# Altium schematic sheet STM32F407VG_A.SchDoc
size A4; SheetNumber: 3; SheetTotal: 8
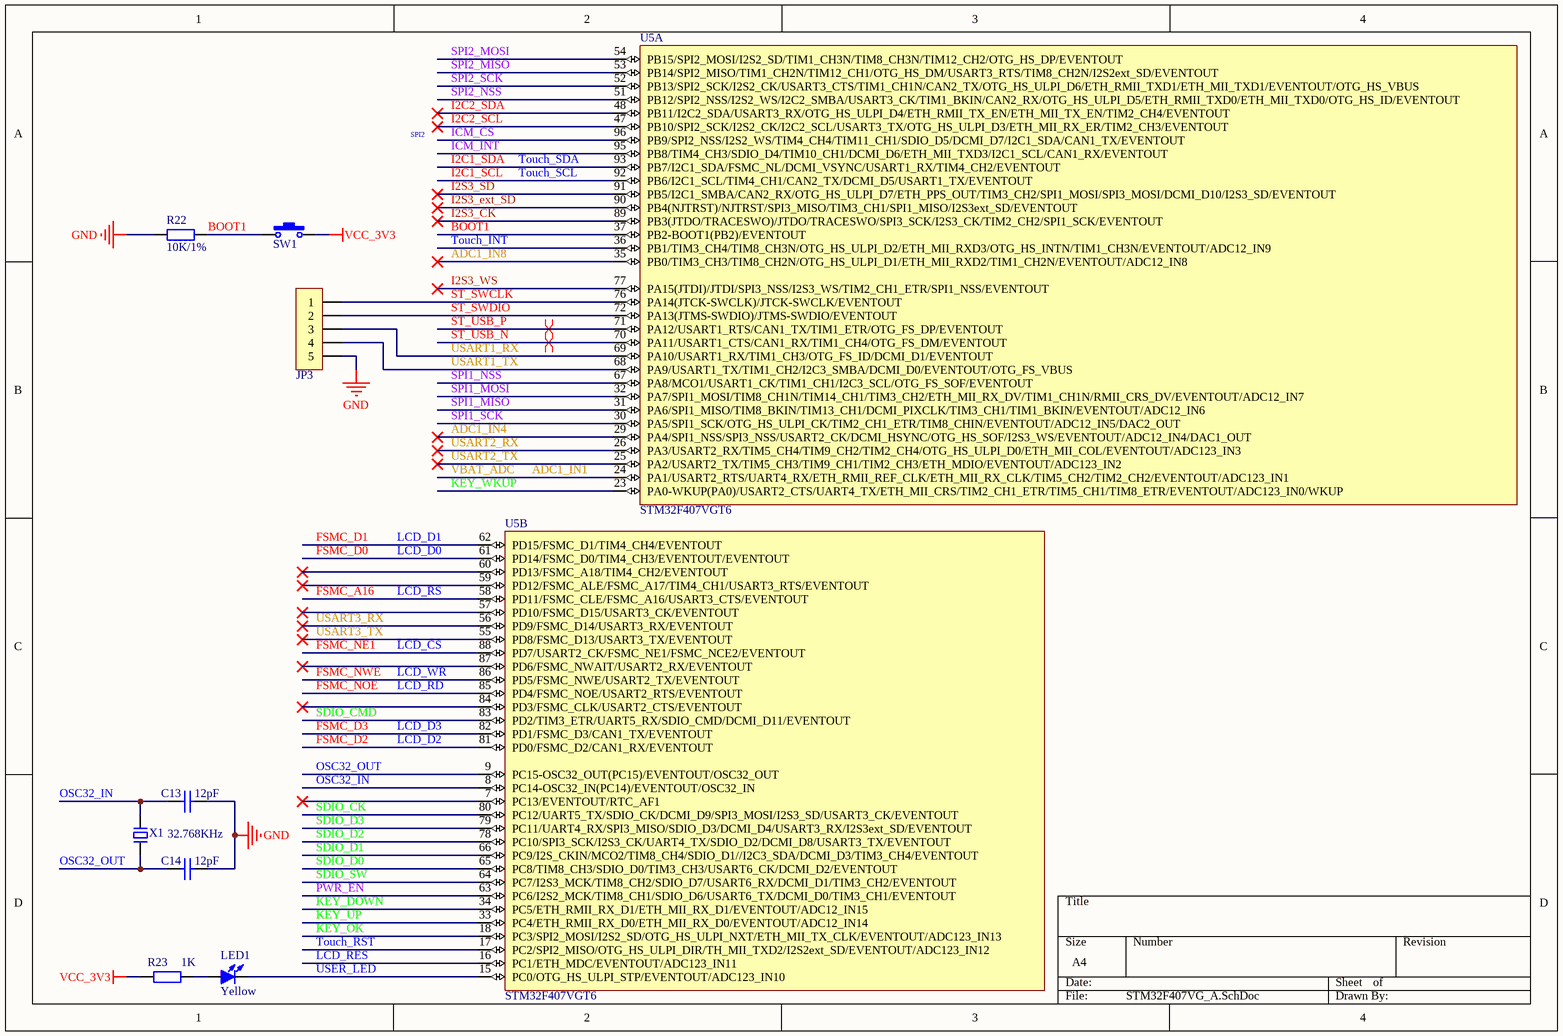
[diagram p0: STM32F407VG_A.SchDoc]

## Parts
C13  12pF  [C0402_L]
C14  12pF  [C0402_L]
JP3  HDR-1X5  [HDR1.27-LI-5P]  (value not drawn)
LED1  Yellow  [LED0402]
R22  10K/1%  [R0402_L]
R23  1K  [R0402_L]
SW1  小龟按键  [3*4两脚小龟按键]  (value not drawn)
U5  STM32F407VGT6  [LQFP100_L]  (parts A,B of 5)
X1  32.768KHz  [XTAL-3215-2P]

## Nets
GND: C13.1 C14.1 JP3.5 R22.1
VCC_3V3: R23.1 SW1.2
ADC1_IN1: U5.24(PA1/USART2_RTS/UART4_RX/ETH_RMII_REF_CLK/ETH_MII_RX_CLK/TIM5_CH2/TIM2_CH2/EVENTOUT/ADC123_IN1)  [also labelled VBAT_ADC]
ADC1_IN4: U5.29(PA4/SPI1_NSS/SPI3_NSS/USART2_CK/DCMI_HSYNC/OTG_HS_SOF/I2S3_WS/EVENTOUT/ADC12_IN4/DAC1_OUT)
ADC1_IN8: U5.35(PB0/TIM3_CH3/TIM8_CH2N/OTG_HS_ULPI_D1/ETH_MII_RXD2/TIM1_CH2N/EVENTOUT/ADC12_IN8)
BOOT1: R22.2 SW1.1 U5.37(PB2-BOOT1(PB2)/EVENTOUT)
FSMC_A16: U5.58(PD11/FSMC_CLE/FSMC_A16/USART3_CTS/EVENTOUT)  [also labelled LCD_RS]
FSMC_D0: U5.61(PD14/FSMC_D0/TIM4_CH3/EVENTOUT/EVENTOUT)  [also labelled LCD_D0]
FSMC_D1: U5.62(PD15/FSMC_D1/TIM4_CH4/EVENTOUT)  [also labelled LCD_D1]
FSMC_D2: U5.81(PD0/FSMC_D2/CAN1_RX/EVENTOUT)  [also labelled LCD_D2]
FSMC_D3: U5.82(PD1/FSMC_D3/CAN1_TX/EVENTOUT)  [also labelled LCD_D3]
FSMC_NE1: U5.88(PD7/USART2_CK/FSMC_NE1/FSMC_NCE2/EVENTOUT)  [also labelled LCD_CS]
FSMC_NOE: U5.85(PD4/FSMC_NOE/USART2_RTS/EVENTOUT)  [also labelled LCD_RD]
FSMC_NWE: U5.86(PD5/FSMC_NWE/USART2_TX/EVENTOUT)  [also labelled LCD_WR]
I2C1_SCL: U5.92(PB6/I2C1_SCL/TIM4_CH1/CAN2_TX/DCMI_D5/USART1_TX/EVENTOUT)  [also labelled Touch_SCL]
I2C1_SDA: U5.93(PB7/I2C1_SDA/FSMC_NL/DCMI_VSYNC/USART1_RX/TIM4_CH2/EVENTOUT)  [also labelled Touch_SDA]
I2C2_SCL: U5.47(PB10/SPI2_SCK/I2S2_CK/I2C2_SCL/USART3_TX/OTG_HS_ULPI_D3/ETH_MII_RX_ER/TIM2_CH3/EVENTOUT)
I2C2_SDA: U5.48(PB11/I2C2_SDA/USART3_RX/OTG_HS_ULPI_D4/ETH_RMII_TX_EN/ETH_MII_TX_EN/TIM2_CH4/EVENTOUT)
I2S3_CK: U5.89(PB3(JTDO/TRACESWO)/JTDO/TRACESWO/SPI3_SCK/I2S3_CK/TIM2_CH2/SPI1_SCK/EVENTOUT)
I2S3_ext_SD: U5.90(PB4(NJTRST)/NJTRST/SPI3_MISO/TIM3_CH1/SPI1_MISO/I2S3ext_SD/EVENTOUT)
I2S3_SD: U5.91(PB5/I2C1_SMBA/CAN2_RX/OTG_HS_ULPI_D7/ETH_PPS_OUT/TIM3_CH2/SPI1_MOSI/SPI3_MOSI/DCMI_D10/I2S3_SD/EVENTOUT)
I2S3_WS: U5.77(PA15(JTDI)/JTDI/SPI3_NSS/I2S3_WS/TIM2_CH1_ETR/SPI1_NSS/EVENTOUT)
ICM_CS: U5.96(PB9/SPI2_NSS/I2S2_WS/TIM4_CH4/TIM11_CH1/SDIO_D5/DCMI_D7/I2C1_SDA/CAN1_TX/EVENTOUT)
ICM_INT: U5.95(PB8/TIM4_CH3/SDIO_D4/TIM10_CH1/DCMI_D6/ETH_MII_TXD3/I2C1_SCL/CAN1_RX/EVENTOUT)
KEY_DOWN: U5.34(PC5/ETH_RMII_RX_D1/ETH_MII_RX_D1/EVENTOUT/ADC12_IN15)
KEY_OK: U5.18(PC3/SPI2_MOSI/I2S2_SD/OTG_HS_ULPI_NXT/ETH_MII_TX_CLK/EVENTOUT/ADC123_IN13)
KEY_UP: U5.33(PC4/ETH_RMII_RX_D0/ETH_MII_RX_D0/EVENTOUT/ADC12_IN14)
KEY_WKUP: U5.23(PA0-WKUP(PA0)/USART2_CTS/UART4_TX/ETH_MII_CRS/TIM2_CH1_ETR/TIM5_CH1/TIM8_ETR/EVENTOUT/ADC123_IN0/WKUP)
LCD_RES: U5.16(PC1/ETH_MDC/EVENTOUT/ADC123_IN11)
OSC32_IN: C13.2 U5.8(PC14-OSC32_IN(PC14)/EVENTOUT/OSC32_IN) X1.2
OSC32_OUT: C14.2 U5.9(PC15-OSC32_OUT(PC15)/EVENTOUT/OSC32_OUT) X1.1
PWR_EN: U5.63(PC6/I2S2_MCK/TIM8_CH1/SDIO_D6/USART6_TX/DCMI_D0/TIM3_CH1/EVENTOUT)
SDIO_CK: U5.80(PC12/UART5_TX/SDIO_CK/DCMI_D9/SPI3_MOSI/I2S3_SD/USART3_CK/EVENTOUT)
SDIO_CMD: U5.83(PD2/TIM3_ETR/UART5_RX/SDIO_CMD/DCMI_D11/EVENTOUT)
SDIO_D0: U5.65(PC8/TIM8_CH3/SDIO_D0/TIM3_CH3/USART6_CK/DCMI_D2/EVENTOUT)
SDIO_D1: U5.66(PC9/I2S_CKIN/MCO2/TIM8_CH4/SDIO_D1//I2C3_SDA/DCMI_D3/TIM3_CH4/EVENTOUT)
SDIO_D2: U5.78(PC10/SPI3_SCK/I2S3_CK/UART4_TX/SDIO_D2/DCMI_D8/USART3_TX/EVENTOUT)
SDIO_D3: U5.79(PC11/UART4_RX/SPI3_MISO/SDIO_D3/DCMI_D4/USART3_RX/I2S3ext_SD/EVENTOUT)
SDIO_SW: U5.64(PC7/I2S3_MCK/TIM8_CH2/SDIO_D7/USART6_RX/DCMI_D1/TIM3_CH2/EVENTOUT)
SPI1_MISO: U5.31(PA6/SPI1_MISO/TIM8_BKIN/TIM13_CH1/DCMI_PIXCLK/TIM3_CH1/TIM1_BKIN/EVENTOUT/ADC12_IN6)
SPI1_MOSI: U5.32(PA7/SPI1_MOSI/TIM8_CH1N/TIM14_CH1/TIM3_CH2/ETH_MII_RX_DV/TIM1_CH1N/RMII_CRS_DV/EVENTOUT/ADC12_IN7)
SPI1_NSS: U5.67(PA8/MCO1/USART1_CK/TIM1_CH1/I2C3_SCL/OTG_FS_SOF/EVENTOUT)
SPI1_SCK: U5.30(PA5/SPI1_SCK/OTG_HS_ULPI_CK/TIM2_CH1_ETR/TIM8_CHIN/EVENTOUT/ADC12_IN5/DAC2_OUT)
SPI2_MISO: U5.53(PB14/SPI2_MISO/TIM1_CH2N/TIM12_CH1/OTG_HS_DM/USART3_RTS/TIM8_CH2N/I2S2ext_SD/EVENTOUT)
SPI2_MOSI: U5.54(PB15/SPI2_MOSI/I2S2_SD/TIM1_CH3N/TIM8_CH3N/TIM12_CH2/OTG_HS_DP/EVENTOUT)
SPI2_NSS: U5.51(PB12/SPI2_NSS/I2S2_WS/I2C2_SMBA/USART3_CK/TIM1_BKIN/CAN2_RX/OTG_HS_ULPI_D5/ETH_RMII_TXD0/ETH_MII_TXD0/OTG_HS_ID/EVENTOUT)
SPI2_SCK: U5.52(PB13/SPI2_SCK/I2S2_CK/USART3_CTS/TIM1_CH1N/CAN2_TX/OTG_HS_ULPI_D6/ETH_RMII_TXD1/ETH_MII_TXD1/EVENTOUT/OTG_HS_VBUS)
ST_SWCLK: JP3.1 U5.76(PA14(JTCK-SWCLK)/JTCK-SWCLK/EVENTOUT)
ST_SWDIO: JP3.2 U5.72(PA13(JTMS-SWDIO)/JTMS-SWDIO/EVENTOUT)
ST_USB_N: U5.70(PA11/USART1_CTS/CAN1_RX/TIM1_CH4/OTG_FS_DM/EVENTOUT)
ST_USB_P: U5.71(PA12/USART1_RTS/CAN1_TX/TIM1_ETR/OTG_FS_DP/EVENTOUT)
Touch_INT: U5.36(PB1/TIM3_CH4/TIM8_CH3N/OTG_HS_ULPI_D2/ETH_MII_RXD3/OTG_HS_INTN/TIM1_CH3N/EVENTOUT/ADC12_IN9)
Touch_RST: U5.17(PC2/SPI2_MISO/OTG_HS_ULPI_DIR/TH_MII_TXD2/I2S2ext_SD/EVENTOUT/ADC123_IN12)
USART1_RX: JP3.3 U5.69(PA10/USART1_RX/TIM1_CH3/OTG_FS_ID/DCMI_D1/EVENTOUT)
USART1_TX: JP3.4 U5.68(PA9/USART1_TX/TIM1_CH2/I2C3_SMBA/DCMI_D0/EVENTOUT/OTG_FS_VBUS)
USART2_RX: U5.26(PA3/USART2_RX/TIM5_CH4/TIM9_CH2/TIM2_CH4/OTG_HS_ULPI_D0/ETH_MII_COL/EVENTOUT/ADC123_IN3)
USART2_TX: U5.25(PA2/USART2_TX/TIM5_CH3/TIM9_CH1/TIM2_CH3/ETH_MDIO/EVENTOUT/ADC123_IN2)
USART3_RX: U5.56(PD9/FSMC_D14/USART3_RX/EVENTOUT)
USART3_TX: U5.55(PD8/FSMC_D13/USART3_TX/EVENTOUT)
USER_LED: LED1.2(K) U5.15(PC0/OTG_HS_ULPI_STP/EVENTOUT/ADC123_IN10)
NetLED1_1: LED1.1(A) R23.2

Not connected (* = marked no-connect by the designer): U5 7(PC13/EVENTOUT/RTC_AF1)* 57(PD10/FSMC_D15/USART3_CK/EVENTOUT)* 59(PD12/FSMC_ALE/FSMC_A17/TIM4_CH1/USART3_RTS/EVENTOUT)* 60(PD13/FSMC_A18/TIM4_CH2/EVENTOUT)* 84(PD3/FSMC_CLK/USART2_CTS/EVENTOUT)* 87(PD6/FSMC_NWAIT/USART2_RX/EVENTOUT)*

## Layout directives
differential pair: ST_USB_N, ST_USB_P

## Notes on the sheet
- SPI2

## Library data of the parts
C13 C14 = C: 贴片电容; BOM名称: 无极性贴片电容; 联系卖家，免费查找封装: 唯一出售店铺网址https://shop463601444.taobao.com
JP3 = Header 5: 5P接插件; 封装库来自淘宝卖家 ID：黄晶宝石: https://shop463601444.taobao.com
LED1 = LED-SMD: 贴片LED; 联系卖家 免费查找封装: 封装库来自淘宝卖家ID：黄晶宝石; BOM名称: 贴片LED
R22 R23 = R: 贴片电阻; 联系卖家，免费查找封装: 唯一出售店铺网址https://shop463601444.taobao.com; BOM名称: 贴片电阻
SW1 = SW-PB: 微动开关; BOM名称: 3x6轻触开关; 联系卖家，免费查找封装: 唯一出售店铺网址https://shop463601444.taobao.com; 封装库来自淘宝卖家ID：黄晶宝石: 其他店铺购入均为盗版假冒封装库，请立即申请退款
U5 = STM32F407VGT6: ARM Cortex-M4 32b MCU+FPU, 210DMIP, 1024 kB Flash, 192+4 kB RAM, Camera, 82 I/Os, 100-pin LQFP, -40 to +85癈, Tray; Internal RAM: 192kB; Operating Frequency (Processor Speed): 168MHz; A/D Converter: 16x12-bit; D/A Converter: 2x12-bit; 16-bit Timers (IC/OC/PWM): 12x16-bit(24/24/30); 32-bit Timer (IC/OC/PWM): 2x32-bit (8/8/8); Other Timer Functions: 2xWDG, RTC, 24-bit down counter; Serial Interface: 3xSPI/2xI2S/2xI2C/3xUSART(IrDa, ISO7816)/3xUART/2xUSB OTG FS/HS, 2xCAN/Ethernet MAC10/100, SDIO; 联系卖家，免费查找封装: 唯一出售店铺网址https://shop463601444.taobao.com; DatasheetVersion: rev2, Jan-2012; PackageVersion: 2012; PackageReference: LQFP100; PackageDescription: 100-Pin Low Profile Quad Flat Package, 14x14 mm Body, 0.5 mm Pitch; ComponentLink1Description: Manufacturer URL; ComponentLink1URL: http://www.st.com/; ComponentLink2Description: STM32F405/7 Datasheet; ComponentLink2URL: http://www.st.com/internet/com/TECHNICAL_RESOURCES/TECHNICAL_LITERATURE/DATASHEET/DM00037051.pdf; ComponentLink3Description: STM32F4 Web Page; ComponentLink3URL: http://www.st.com/internet/mcu/subclass/1521.jsp
X1 = XTAL-2P: 2脚无源晶振(谐振器）; 联系卖家，免费查找封装: 唯一出售店铺网址https://shop463601444.taobao.com; BOM名称: 2脚无源晶振(谐振器）